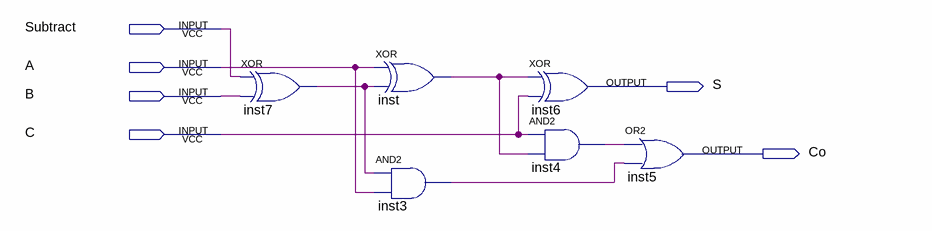
[diagram p0: schematic sheet]
// Quartus schematic Full_Adder_Sub.bdf as structural Verilog: 6 symbols, 6 pins
module Full_Adder_Sub (
  input  Subtract,
  input  A,
  input  B,
  input  C,
  output S,
  output Co
);

  wire inst3_out, inst4_out, inst7_out, inst_out;

  xor inst7 (inst7_out, Subtract, B);
  xor inst (inst_out, A, inst7_out);
  and inst3 (inst3_out, inst7_out, A);
  xor inst6 (S, inst_out, C);
  and inst4 (inst4_out, C, inst_out);
  or inst5 (Co, inst4_out, inst3_out);
endmodule
